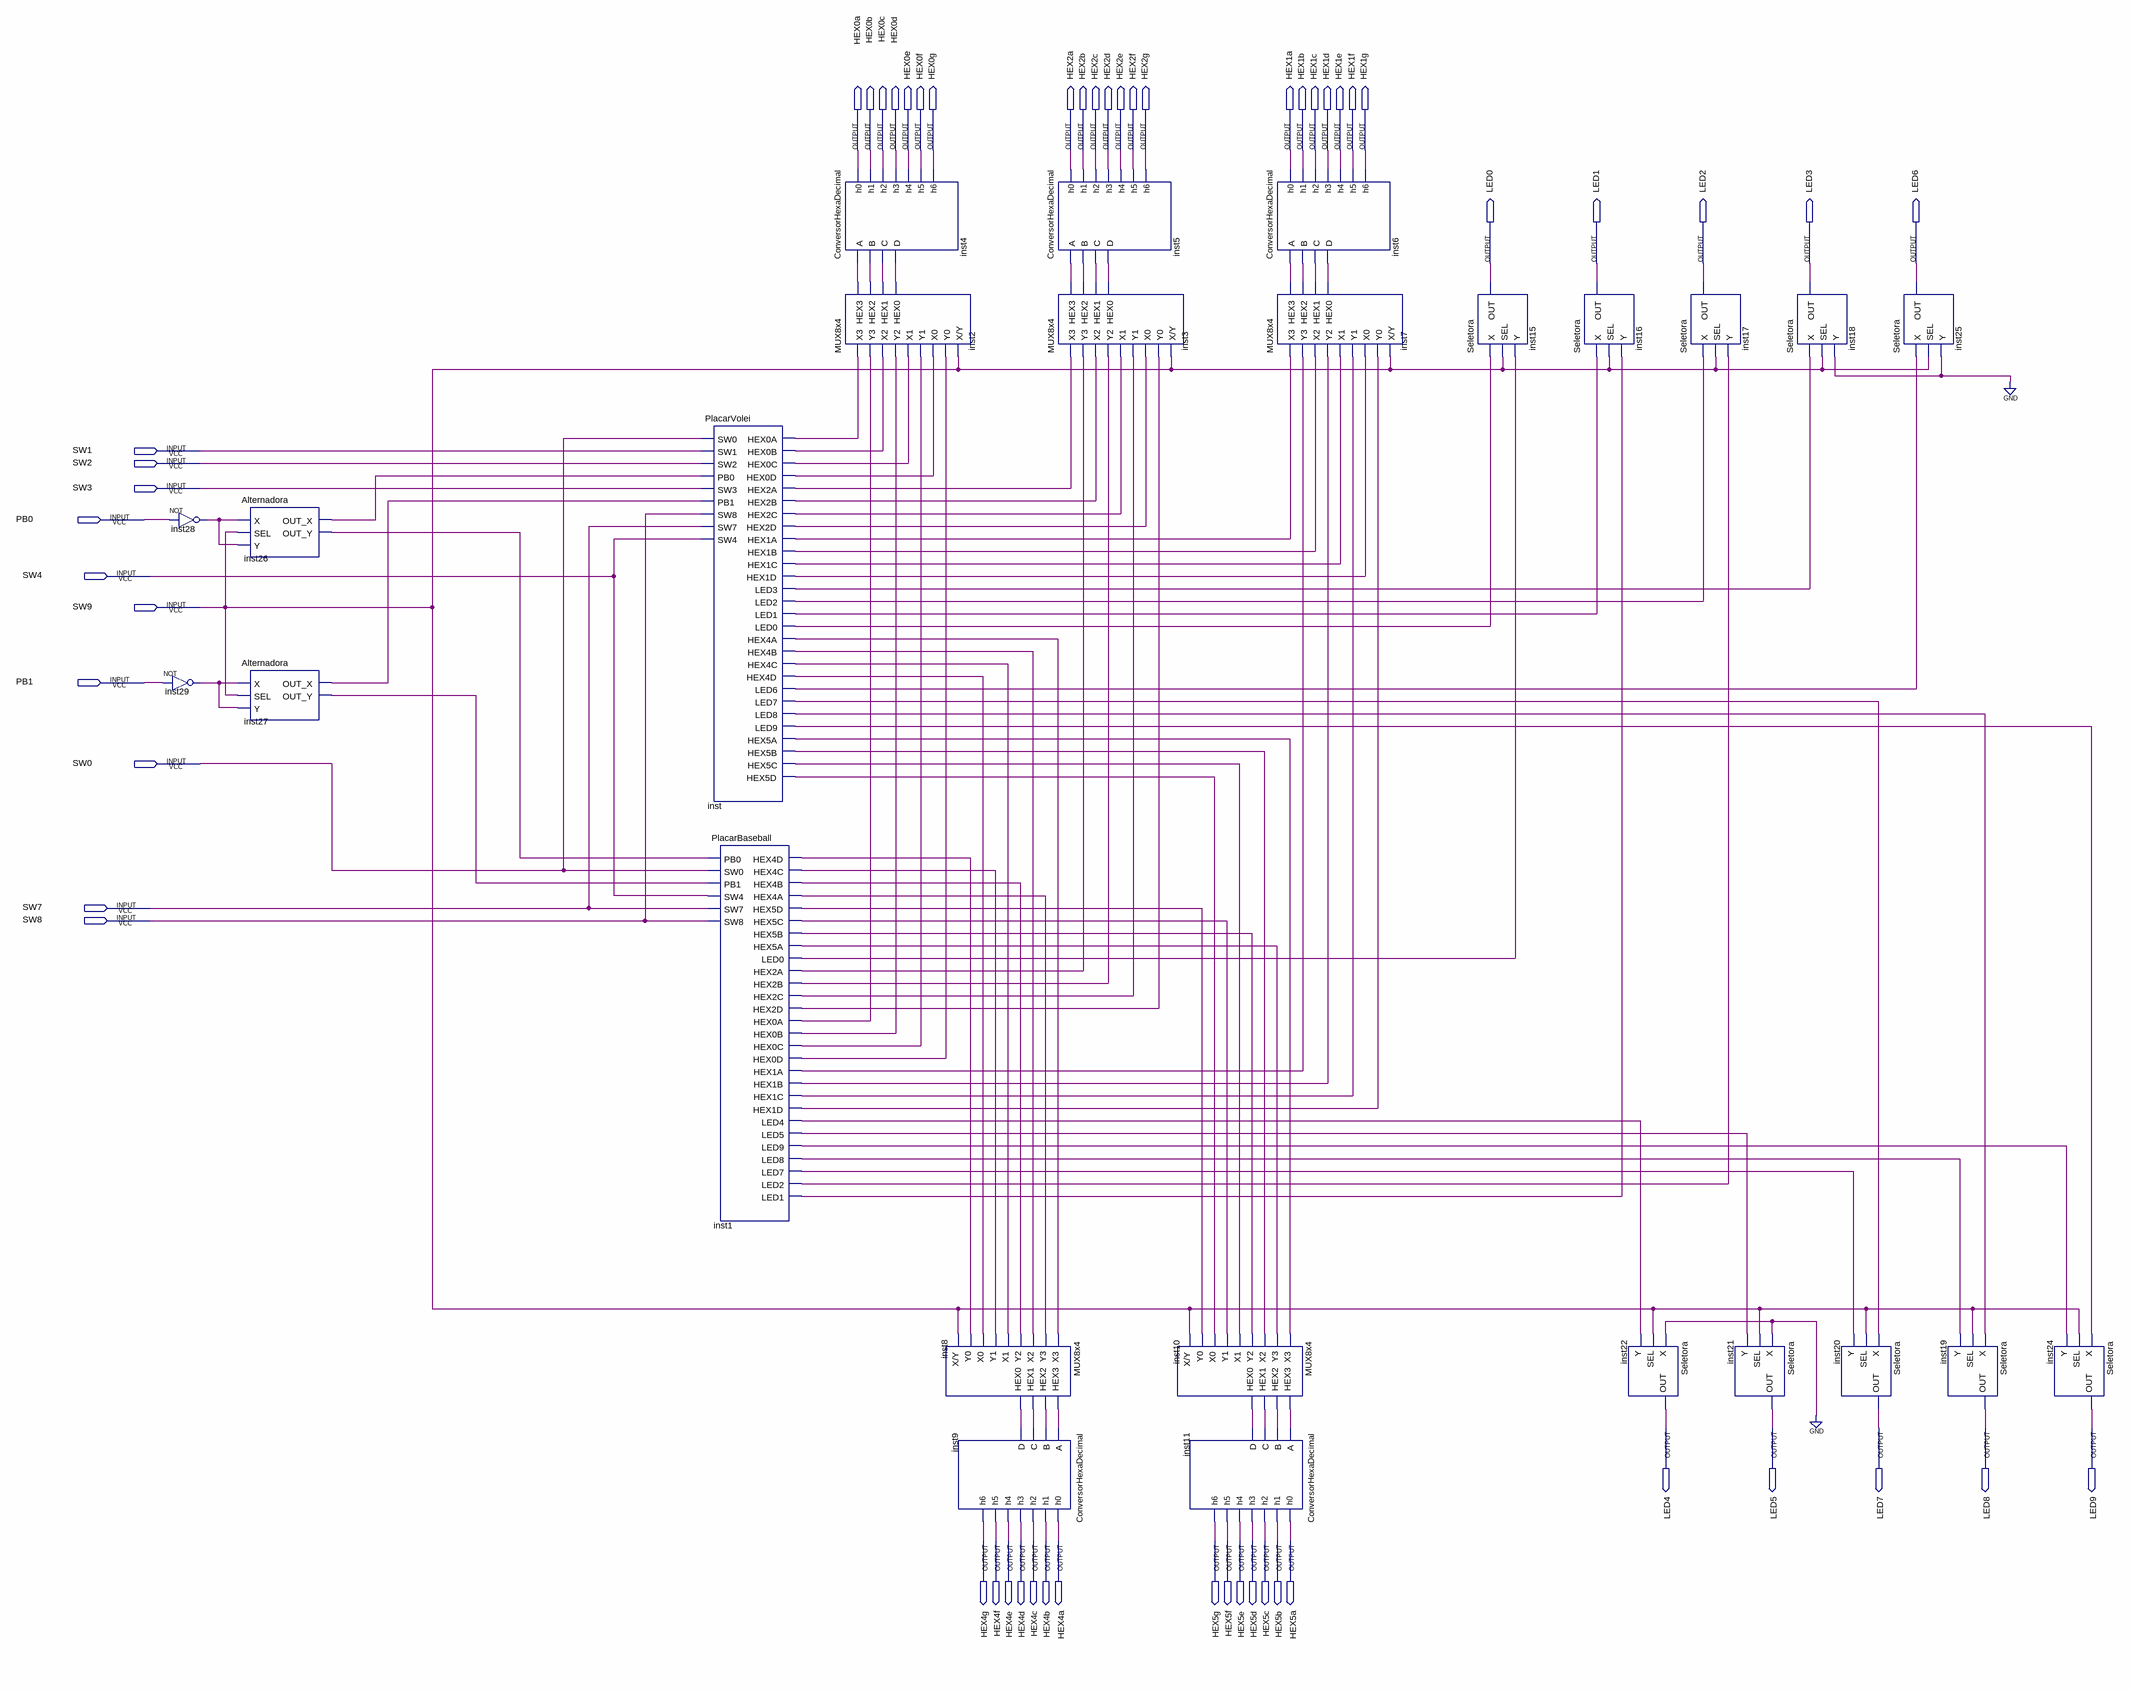
[diagram p0: schematic sheet]
// Quartus schematic LABFinal.bdf as structural Verilog: 26 symbols, 55 pins
module LABFinal (
  input  SW1,
  input  SW2,
  input  SW3,
  input  PB0,
  input  SW4,
  input  SW9,
  input  PB1,
  input  SW0,
  input  SW7,
  input  SW8,
  output HEX0a,
  output HEX0b,
  output HEX0c,
  output HEX0d,
  output HEX0e,
  output HEX0f,
  output HEX0g,
  output HEX2a,
  output HEX2b,
  output HEX2c,
  output HEX2d,
  output HEX2e,
  output HEX2f,
  output HEX2g,
  output HEX1a,
  output HEX1b,
  output HEX1c,
  output HEX1d,
  output HEX1e,
  output HEX1f,
  output HEX1g,
  output LED0,
  output LED1,
  output LED2,
  output LED3,
  output LED6,
  output LED4,
  output LED5,
  output LED7,
  output LED8,
  output LED9,
  output HEX4g,
  output HEX4f,
  output HEX4e,
  output HEX4d,
  output HEX4c,
  output HEX4b,
  output HEX4a,
  output HEX5g,
  output HEX5f,
  output HEX5e,
  output HEX5d,
  output HEX5c,
  output HEX5b,
  output HEX5a
);

  wire inst1_hex0a, inst1_hex0b, inst1_hex0c, inst1_hex0d, inst1_hex1a, inst1_hex1b, inst1_hex1c,
       inst1_hex1d, inst1_hex2a, inst1_hex2b, inst1_hex2c, inst1_hex2d, inst1_hex4a, inst1_hex4b,
       inst1_hex4c, inst1_hex4d, inst1_hex5a, inst1_hex5b, inst1_hex5c, inst1_hex5d, inst1_led0, inst1_led1,
       inst1_led2, inst1_led4, inst1_led5, inst1_led7, inst1_led8, inst1_led9, inst2_hex0, inst2_hex1,
       inst2_hex2, inst2_hex3, inst3_hex0, inst3_hex1, inst3_hex2, inst3_hex3, inst7_hex0, inst7_hex1,
       inst7_hex2, inst7_hex3, inst8_hex0, inst8_hex1, inst8_hex2, inst8_hex3, inst10_hex0, inst10_hex1,
       inst10_hex2, inst10_hex3, inst26_out_x, inst26_out_y, inst27_out_x, inst27_out_y, inst28_out,
       inst29_out, inst_hex0a, inst_hex0b, inst_hex0c, inst_hex0d, inst_hex1a, inst_hex1b, inst_hex1c,
       inst_hex1d, inst_hex2a, inst_hex2b, inst_hex2c, inst_hex2d, inst_hex4a, inst_hex4b, inst_hex4c,
       inst_hex4d, inst_hex5a, inst_hex5b, inst_hex5c, inst_hex5d, inst_led0, inst_led1, inst_led2,
       inst_led3, inst_led6, inst_led7, inst_led8, inst_led9;

  not inst28 (inst28_out, PB0);
  not inst29 (inst29_out, PB1);
  Alternadora inst26 (.X(inst28_out), .SEL(SW9), .Y(inst28_out), .OUT_X(inst26_out_x), .OUT_Y(inst26_out_y));
  Alternadora inst27 (.X(inst29_out), .SEL(SW9), .Y(inst29_out), .OUT_X(inst27_out_x), .OUT_Y(inst27_out_y));
  PlacarVolei inst (
    .SW0(SW0), .SW1(SW1), .SW2(SW2), .PB0(inst26_out_x), .SW3(SW3), .PB1(inst27_out_x), .SW8(SW8), .SW7(SW7),
    .SW4(SW4), .HEX0A(inst_hex0a), .HEX0B(inst_hex0b), .HEX0C(inst_hex0c), .HEX0D(inst_hex0d),
    .HEX2A(inst_hex2a), .HEX2B(inst_hex2b), .HEX2C(inst_hex2c), .HEX2D(inst_hex2d), .HEX1A(inst_hex1a),
    .HEX1B(inst_hex1b), .HEX1C(inst_hex1c), .HEX1D(inst_hex1d), .LED3(inst_led3), .LED2(inst_led2),
    .LED1(inst_led1), .LED0(inst_led0), .HEX4A(inst_hex4a), .HEX4B(inst_hex4b), .HEX4C(inst_hex4c),
    .HEX4D(inst_hex4d), .LED6(inst_led6), .LED7(inst_led7), .LED8(inst_led8), .LED9(inst_led9),
    .HEX5A(inst_hex5a), .HEX5B(inst_hex5b), .HEX5C(inst_hex5c), .HEX5D(inst_hex5d));
  PlacarBaseball inst1 (
    .PB0(inst26_out_y), .SW0(SW0), .PB1(inst27_out_y), .SW4(SW4), .SW7(SW7), .SW8(SW8), .HEX4D(inst1_hex4d),
    .HEX4C(inst1_hex4c), .HEX4B(inst1_hex4b), .HEX4A(inst1_hex4a), .HEX5D(inst1_hex5d), .HEX5C(inst1_hex5c),
    .HEX5B(inst1_hex5b), .HEX5A(inst1_hex5a), .LED0(inst1_led0), .HEX2A(inst1_hex2a), .HEX2B(inst1_hex2b),
    .HEX2C(inst1_hex2c), .HEX2D(inst1_hex2d), .HEX0A(inst1_hex0a), .HEX0B(inst1_hex0b), .HEX0C(inst1_hex0c),
    .HEX0D(inst1_hex0d), .HEX1A(inst1_hex1a), .HEX1B(inst1_hex1b), .HEX1C(inst1_hex1c), .HEX1D(inst1_hex1d),
    .LED4(inst1_led4), .LED5(inst1_led5), .LED9(inst1_led9), .LED8(inst1_led8), .LED7(inst1_led7),
    .LED2(inst1_led2), .LED1(inst1_led1));
  ConversorHexaDecimal inst4 (
    .A(inst2_hex3), .B(inst2_hex2), .C(inst2_hex1), .D(inst2_hex0), .h0(HEX0a), .h1(HEX0b), .h2(HEX0c),
    .h3(HEX0d), .h4(HEX0e), .h5(HEX0f), .h6(HEX0g));
  MUX8x4 inst2 (
    .X3(inst_hex0a), .Y3(inst1_hex0a), .X2(inst_hex0b), .Y2(inst1_hex0b), .X1(inst_hex0c), .Y1(inst1_hex0c),
    .X0(inst_hex0d), .Y0(inst1_hex0d), .\X/Y (SW9), .HEX3(inst2_hex3), .HEX2(inst2_hex2), .HEX1(inst2_hex1),
    .HEX0(inst2_hex0));
  MUX8x4 inst8 (
    .X3(inst_hex4a), .Y3(inst1_hex4a), .X2(inst_hex4b), .Y2(inst1_hex4b), .X1(inst_hex4c), .Y1(inst1_hex4c),
    .X0(inst_hex4d), .Y0(inst1_hex4d), .\X/Y (SW9), .HEX3(inst8_hex3), .HEX2(inst8_hex2), .HEX1(inst8_hex1),
    .HEX0(inst8_hex0));
  ConversorHexaDecimal inst9 (
    .A(inst8_hex3), .B(inst8_hex2), .C(inst8_hex1), .D(inst8_hex0), .h0(HEX4a), .h1(HEX4b), .h2(HEX4c),
    .h3(HEX4d), .h4(HEX4e), .h5(HEX4f), .h6(HEX4g));
  ConversorHexaDecimal inst5 (
    .A(inst3_hex3), .B(inst3_hex2), .C(inst3_hex1), .D(inst3_hex0), .h0(HEX2a), .h1(HEX2b), .h2(HEX2c),
    .h3(HEX2d), .h4(HEX2e), .h5(HEX2f), .h6(HEX2g));
  MUX8x4 inst3 (
    .X3(inst_hex2a), .Y3(inst1_hex2a), .X2(inst_hex2b), .Y2(inst1_hex2b), .X1(inst_hex2c), .Y1(inst1_hex2c),
    .X0(inst_hex2d), .Y0(inst1_hex2d), .\X/Y (SW9), .HEX3(inst3_hex3), .HEX2(inst3_hex2), .HEX1(inst3_hex1),
    .HEX0(inst3_hex0));
  MUX8x4 inst10 (
    .X3(inst_hex5a), .Y3(inst1_hex5a), .X2(inst_hex5b), .Y2(inst1_hex5b), .X1(inst_hex5c), .Y1(inst1_hex5c),
    .X0(inst_hex5d), .Y0(inst1_hex5d), .\X/Y (SW9), .HEX3(inst10_hex3), .HEX2(inst10_hex2),
    .HEX1(inst10_hex1), .HEX0(inst10_hex0));
  ConversorHexaDecimal inst11 (
    .A(inst10_hex3), .B(inst10_hex2), .C(inst10_hex1), .D(inst10_hex0), .h0(HEX5a), .h1(HEX5b), .h2(HEX5c),
    .h3(HEX5d), .h4(HEX5e), .h5(HEX5f), .h6(HEX5g));
  ConversorHexaDecimal inst6 (
    .A(inst7_hex3), .B(inst7_hex2), .C(inst7_hex1), .D(inst7_hex0), .h0(HEX1a), .h1(HEX1b), .h2(HEX1c),
    .h3(HEX1d), .h4(HEX1e), .h5(HEX1f), .h6(HEX1g));
  MUX8x4 inst7 (
    .X3(inst_hex1a), .Y3(inst1_hex1a), .X2(inst_hex1b), .Y2(inst1_hex1b), .X1(inst_hex1c), .Y1(inst1_hex1c),
    .X0(inst_hex1d), .Y0(inst1_hex1d), .\X/Y (SW9), .HEX3(inst7_hex3), .HEX2(inst7_hex2), .HEX1(inst7_hex1),
    .HEX0(inst7_hex0));
  Seletora inst15 (.X(inst_led0), .SEL(SW9), .Y(inst1_led0), .OUT(LED0));
  Seletora inst16 (.X(inst_led1), .SEL(SW9), .Y(inst1_led1), .OUT(LED1));
  Seletora inst22 (.X(1'b0), .SEL(SW9), .Y(inst1_led4), .OUT(LED4));
  Seletora inst17 (.X(inst_led2), .SEL(SW9), .Y(inst1_led2), .OUT(LED2));
  Seletora inst21 (.X(1'b0), .SEL(SW9), .Y(inst1_led5), .OUT(LED5));
  Seletora inst18 (.X(inst_led3), .SEL(SW9), .Y(1'b0), .OUT(LED3));
  Seletora inst20 (.X(inst_led7), .SEL(SW9), .Y(inst1_led7), .OUT(LED7));
  Seletora inst25 (.X(inst_led6), .SEL(SW9), .Y(1'b0), .OUT(LED6));
  Seletora inst19 (.X(inst_led8), .SEL(SW9), .Y(inst1_led8), .OUT(LED8));
  Seletora inst24 (.X(inst_led9), .SEL(SW9), .Y(inst1_led9), .OUT(LED9));
endmodule
